# EAGLE design counter (EAGLE 9.6.2)
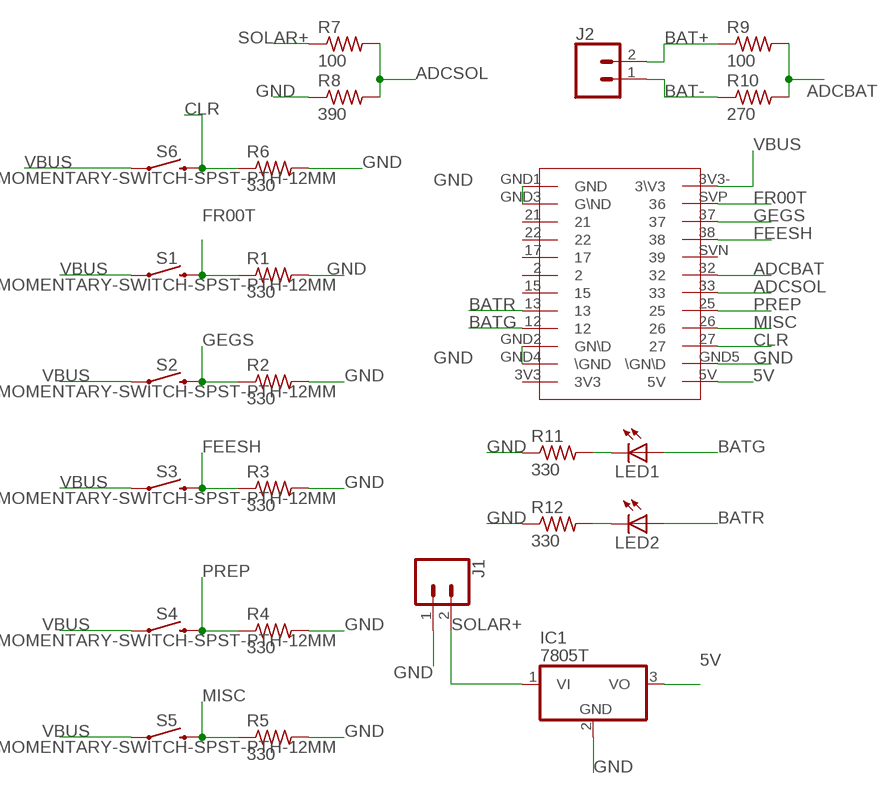
[diagram p0: schematic, sheet 1]

## Parts
IC1  7805T  [TO220H]
J1  CONN_02  [1X02]
J2  CONN_02  [1X02]
LED1  LED3MM  [LED3MM]
LED2  LED3MM  [LED3MM]
R1  330  R-US_0204/7  [0204/7]
R2  330  R-US_0204/7  [0204/7]
R3  330  R-US_0204/7  [0204/7]
R4  330  R-US_0204/7  [0204/7]
R5  330  R-US_0204/7  [0204/7]
R6  330  R-US_0204/7  [0204/7]
R7  100  R-US_0204/7  [0204/7]
R8  390  R-US_0204/7  [0204/7]
R9  100  R-US_0204/7  [0204/7]
R10  270  R-US_0204/7  [0204/7]
R11  330  R-US_0204/7  [0204/7]
R12  330  R-US_0204/7  [0204/7]
S1  MOMENTARY-SWITCH-SPST-PTH-12MM  [TACTILE_SWITCH_PTH_12MM]
S2  MOMENTARY-SWITCH-SPST-PTH-12MM  [TACTILE_SWITCH_PTH_12MM]
S3  MOMENTARY-SWITCH-SPST-PTH-12MM  [TACTILE_SWITCH_PTH_12MM]
S4  MOMENTARY-SWITCH-SPST-PTH-12MM  [TACTILE_SWITCH_PTH_12MM]
S5  MOMENTARY-SWITCH-SPST-PTH-12MM  [TACTILE_SWITCH_PTH_12MM]
S6  MOMENTARY-SWITCH-SPST-PTH-12MM  [TACTILE_SWITCH_PTH_12MM]
U$1  TTGO-4MB  [ESP32-TTGO-TDISPLAY]

## Nets
5V: IC1.3(VO) U$1.5V
ADCBAT: R9.2 R10.2 U$1.32
ADCSOL: R7.2 R8.2 U$1.33
BAT+: J2.2 R9.1
BAT-: J2.1 R10.1
BATG: LED1.A U$1.12
BATR: LED2.A U$1.13
CLR: R6.1 S6.3 U$1.27
FEESH: R3.1 S3.3 U$1.38
FR00T: R1.1 S1.3 U$1.SVP
GEGS: R2.1 S2.3 U$1.37
GND: IC1.2(GND) J1.1 R1.2 R2.2 R3.2 R4.2 R5.2 R6.2 R8.1 R11.1 R12.1 U$1.GND1(GND) U$1.GND2(GN\D) U$1.GND3(G\ND) U$1.GND4(\GND) U$1.GND5(\GN\D)
MISC: R5.1 S5.3 U$1.26
N$8: LED1.K(C) R11.2
N$9: LED2.K(C) R12.2
PREP: R4.1 S4.3 U$1.25
SOLAR+: IC1.1(VI) J1.2 R7.1
VBUS: S1.1 S2.1 S3.1 S4.1 S5.1 S6.1 U$1.3V3-(3\V3)
Unconnected: U$1.2 U$1.3V3 U$1.15 U$1.17 U$1.21 U$1.22 U$1.SVN

## Library data of the parts
IC1 = adafruit:78*: Positive VOLTAGE REGULATOR Added bigger pads to the TO-92 package
J1 J2 = SparkFun-Connectors:CONN_02: Multi connection point. Often used as Generic Header-pin footprint for 0.1 inch spaced/style header connections On any of the 0.1 inch spaced packages, you can populate with these: Break Away Headers - Straight <https://www.sparkfun.com/products/116> (PRT-00116) Break Away Male Headers - Right Angle <https://www.sparkfun.com/products/553> (PRT-00553) Female Headers <https://www.sparkfun.com/products/115> (PRT-00115) Break Away Headers - Machine Pin <https://www.sparkfun.com/products/117> (PRT-00117) Break Away Female Headers - Swiss Machine Pin <https://www.sparkfun.com/products/743> (PRT-00743) For SCREWTERMINALS and SPRING TERMINALS visit here: Screw Terimnals on SparkFun.com <https://www.sparkfun.com/search/results?term=Screw+Terminals> (5mm/3.5mm/2.54mm spacing) This device is also useful as a general connection point to wire up your design to another part of your project. Our various solder wires solder well into these plated through hole pads. Hook-Up Wire - Assortment (Stranded, 22 AWG) <https://www.sparkfun.com/products/11375> (PRT-11375) Hook-Up Wire - Assortment (Solid Core, 22 AWG) <https://www.sparkfun.com/products/11367> (PRT-11367) View the entire wire category on our website here <https://www.sparkfun.com/categories/141> Special notes: Molex polarized connector foot print use with: PRT-08233 with associated crimp pins and housings. 2.54_SCREWTERM for use with PRT-10571. 3.5mm Screw Terminal footprints for PRT-08084 5mm Screw Terminal footprints for use with PRT-08432
LED1 LED2 = adafruit:LED: LED OSRAM: - CHIPLED LG R971, LG N971, LY N971, LG Q971, LY Q971, LO R971, LY R971 LH N974, LH R974 LS Q976, LO Q976, LY Q976 LO Q996 - Hyper CHIPLED LW Q18S LB Q993, LB Q99A, LB R99A - SideLED LS A670, LO A670, LY A670, LG A670, LP A670 LB A673, LV A673, LT A673, LW A673 LH A674 LY A675 LS A676, LA A676, LO A676, LY A676, LW A676 LS A679, LY A679, LG A679 - Hyper Micro SIDELED® LS Y876, LA Y876, LO Y876, LY Y876 LT Y87S - SmartLED LW L88C, LW L88S LB L89C, LB L89S, LG L890 LS L89K, LO L89K, LY L89K LS L896, LA L896, LO L896, LY L896 - TOPLED LS T670, LO T670, LY T670, LG T670, LP T670 LSG T670, LSP T670, LSY T670, LOP T670, LYG T670 LG T671, LOG T671, LSG T671 LB T673, LV T673, LT T673, LW T673 LH T674 LS T676, LA T676, LO T676, LY T676, LB T676, LH T676, LSB T676, LW T676 LB T67C, LV T67C, LT T67C, LS T67K, LO T67K, LY T67K, LW E67C LS E67B, LA E67B, LO E67B, LY E67B, LB E67C, LV E67C, LT E67C LW T67C LS T679, LY T679, LG T679 LS T770, LO T770, LY T770, LG T770, LP T770 LB T773, LV T773, LT T773, LW T773 LH T774 LS E675, LA E675, LY E675, LS T675 LS T776, LA T776, LO T776, LY T776, LB T776 LHGB T686 LT T68C, LB T68C - Hyper Mini TOPLED® LB M676 - Mini TOPLED Santana® LG M470 LS M47K, LO M47K, LY M47K Source: http://www.osram.convergy.de/
R1-R12 = adafruit:R-US_: RESISTOR, American symbol
S1-S6 = SparkFun-Switches:MOMENTARY-SWITCH-SPST: Momentary Switch (Pushbutton) - SPST Normally-open (NO) SPST momentary switches (buttons, pushbuttons). Variants PTH-12MM - 12mm square, through-hole Momentary Pushbutton Switch - 12mm Square <https://www.sparkfun.com/products/9190> (COM-09190) PTH-6.0MM, PTH-6.0MM-KIT - 6.0mm square, through-hole Mini Pushbutton Switch <https://www.sparkfun.com/products/97> (COM-00097) KIT package intended for soldering kit's - only one side of pads' copper is exposed. PTH-RIGHT-ANGLE-KIT - Right-angle, through-hole Right Angle Tactile Button <https://www.sparkfun.com/products/10791> - Used on SparkFun BigTime Watch Kit <https://www.sparkfun.com/products/11734> SMD-12MM - 12mm square, surface-mount Tactile Button - SMD (12mm) <https://www.sparkfun.com/products/12993> (COM-12993) Used on SparkFun PicoBoard <https://www.sparkfun.com/products/11888> SMD-4.5MM - 4.5mm Square Trackball Switch Used on SparkFun Blackberry Trackballer Breakout <https://www.sparkfun.com/products/13169> SMD-4.6MMX2.8MM - 4.60mm x 2.80mm, surface mount Used on SparkFun SAMD21 Mini Breakout <https://www.sparkfun.com/products/13664> SMD-5.2MM, SMD-5.2-REDUNDANT - 5.2mm square, surface-mount Mini Pushbutton Switch - SMD <https://www.sparkfun.com/products/8720> (COM-08720) Used on Arduino Pro Mini <https://www.sparkfun.com/products/11114> REDUNDANT package connects both switch circuits together SMD-6.0X3.5MM - 6.0 x 3.5mm, surface mount Momentary Reset Switch SMD <https://www.sparkfun.com/products/8229> (COM-08229) SMD-6.2MM-TALL - 6.2mm square, surface mount Tactile Button - SMD (6mm) <https://www.sparkfun.com/products/12992> Used on SparkFun Digital Sandbox <https://www.sparkfun.com/products/12651> SMD-RIGHT-ANGLE - Right-angle, surface mount Used on SparkFun Block for Intel® Edison - Arduino <https://www.sparkfun.com/products/13036>; PROD_ID: SWCH-09185; SF_SKU: COM-09190
U$1 = EPS32_TTGO_TDISPLAY:TTGO-4MB

## Board
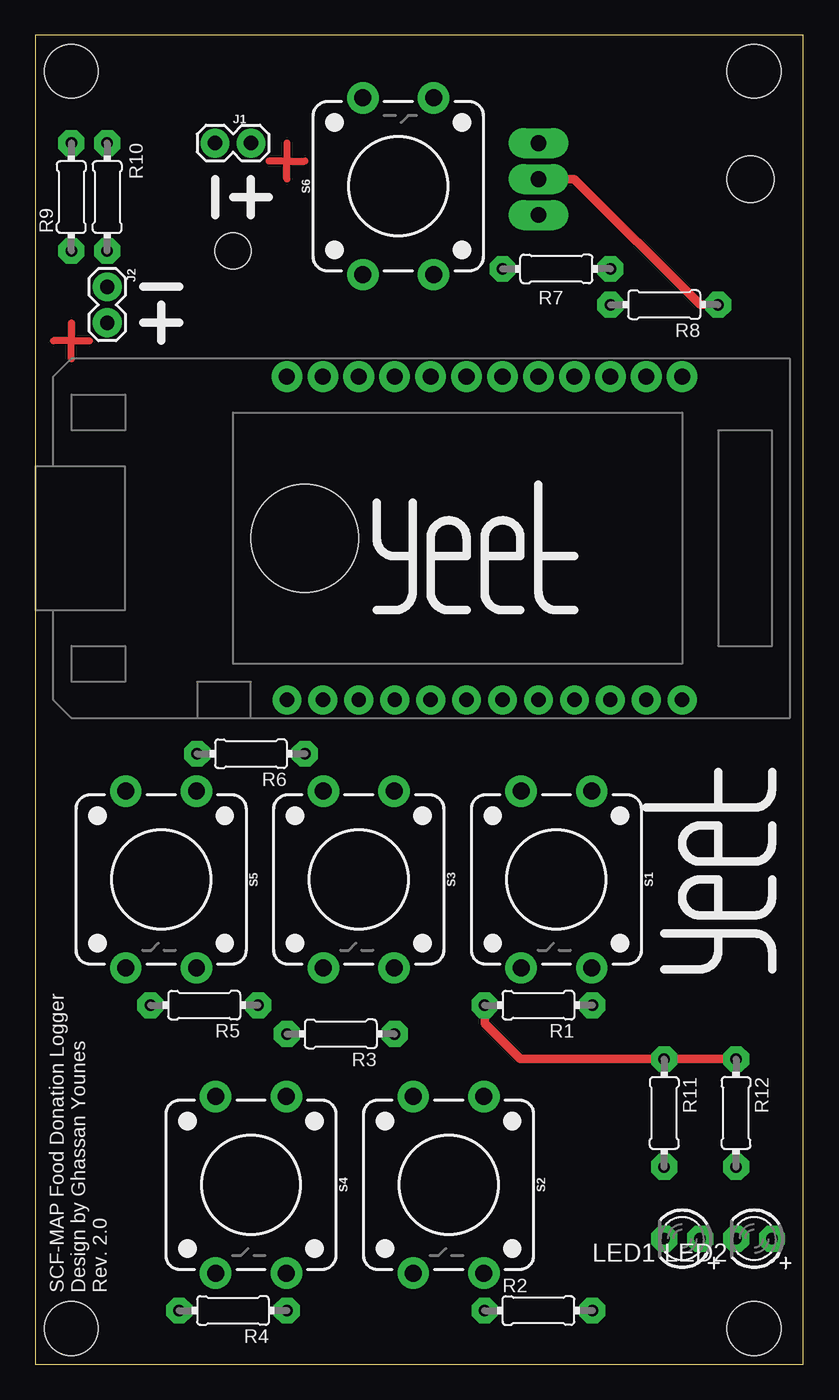
[diagram p1: board, top side]
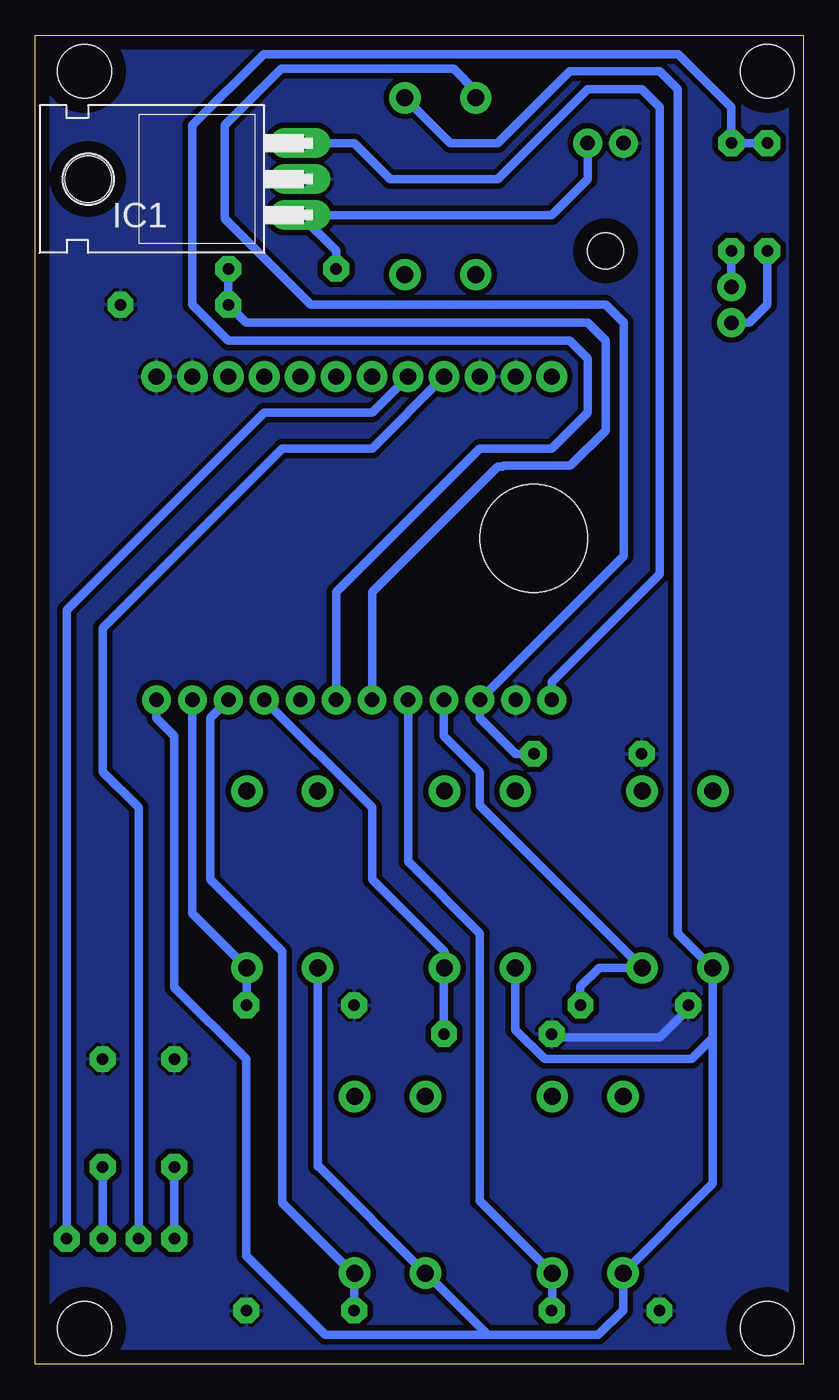
[diagram p2: board, bottom side, seen from below]

Size 54.28 x 93.96 mm. Coordinates in mm from the lower left corner, seen from the top.
Outline: 0,93.96 0,0 54.28,0 54.28,93.96 0,93.96
Copper layers (1*16): Top 0.035mm / dielectric 1.5mm / Bottom 0.035mm
Design rules "default *": minimum track width 6mil, minimum drill 0.35mm, track to track 15mil, track to pad 15mil, pad to pad 15mil, via to via 15mil, smd to smd 6mil, copper to edge 40mil, drill to drill 6mil, minimum pad ring 20mil, minimum via ring 8mil, stop-mask expansion 4mil, vias tented up to drill 0mil, thermal gap 10mil
Holes 3.81 mm at 50.8,91.42 2.54,2.52 50.8,2.52 2.54,91.42
Holes 7.62 mm at 19.05,58.4
Holes 2.54 mm at 13.97,78.72

### Footprints (pad centres in the part's own frame; a part is rotated, then mirrored left to right if it is on the bottom)
TO220H = drill 1.118 long: 1 -2.54,-10.16; 2 0,-10.16; 3 2.54,-10.16 | hole 3.302: 0,4.826
1X02 = drill 1.016 pad 1.88: 1 0,0; 2 2.54,0
LED3MM = drill 0.813 pad 1.676 octagon: A -1.27,0; K 1.27,0
0204/7 = drill 0.813 pad 1.676 octagon: 1 -3.81,0; 2 3.81,0
TACTILE_SWITCH_PTH_12MM = drill 1.2 pad 2.159: 1 6.25,-2.5; 2 -6.25,-2.5; 3 6.25,2.5; 4 -6.25,2.5
ESP32-TTGO-TDISPLAY = drill 1.143 pad 1.778: 2 0,15.24; 3V3 0,0; 12 0,7.62; 13 0,10.16; 15 0,12.7; 17 0,17.78; 21 0,22.86; 22 0,20.32; GND1 0,27.94; GND2 0,25.4; GND3 0,5.08; GND4 0,2.54 | drill 1.016 pad 1.778: 3V3- 22.86,27.94; 5V 22.86,0; 25 22.86,10.16; 26 22.86,7.62; 27 22.86,5.08; 32 22.86,15.24; 33 22.86,12.7; 37 22.86,22.86; 38 22.86,20.32; GND5 22.86,2.54; SVN 22.86,17.78; SVP 22.86,25.4

### Placement (x,y rotation side)
IC1  45.72,83.8 90 bottom
J1  12.7,86.34 0 top
J2  5.08,76.18 270 top
LED1  45.72,8.87 180 top
LED2  50.8,8.87 180 top
R1  35.56,25.38 180 top
R2  35.56,3.79 0 top
R3  21.59,23.35 180 top
R4  13.97,3.79 180 top
R5  11.94,25.38 180 top
R6  15.24,43.16 180 top
R7  36.83,77.45 0 top
R8  44.45,74.91 180 top
R9  2.54,82.53 90 top
R10  5.08,82.53 90 top
R11  44.45,17.76 270 top
R12  49.53,17.76 270 top
S1  36.83,34.27 270 top
S2  29.21,12.68 270 top
S3  22.86,34.27 270 top
S4  15.24,12.68 270 top
S5  8.89,34.27 270 top
S6  25.65,83.29 90 top
U$1  17.78,69.83 270 top

### Tracks (layer width: path | path; a pad name or v marks a point on that pad's centre or on a via)
5V
  Bottom 0.61: IC1.3 31.75,86.34 29.21,83.8 21.59,83.8 15.24,90.15 11.43,90.15 10.16,88.88 10.16,55.86 17.78,48.24 U$1.5V
ADCBAT
  Bottom 0.61: R9.2 R10.2 5.08,88.88 8.84,92.64 38.15,92.64 43.18,87.61 43.18,74.91 40.64,72.37 16.51,72.37 15.24,71.1 15.24,67.29 17.78,64.75 22.86,64.75 33.02,54.59 U$1.32
ADCSOL
  Bottom 0.61: R7.2 R8.2 39.37,73.64 15.24,73.64 13.97,72.37 13.97,66.02 16.46,63.53 21.18,63.53 21.23,63.48 21.59,63.48 30.48,54.59 U$1.33
BAT+
  Bottom 0.61: J2.2 3.81,73.64 2.54,74.91 R9.1
BAT-
  Bottom 0.61: J2.1 R10.1
BATG
  Bottom 0.61: U$1.12 30.48,64.75 36.83,64.75 49.53,52.05 49.53,41.89 46.99,39.35 LED1.A
BATR
  Bottom 0.61: U$1.13 30.48,67.29 38.1,67.29 52.07,53.32 LED2.A
CLR
  Bottom 0.61: S6.3 23.15,90.02 24.72,91.59 36.92,91.59 40.89,87.61 40.89,81.01 34.8,74.91 13.97,74.91 12.7,73.64 12.7,57.13 U$1.27 22.86,45.7 20.32,43.16 R6.1
FEESH
  Bottom 0.61: U$1.38 30.48,39.35 30.48,34.27 25.36,29.15 S3.3 25.4,27.98 R3.1
FR00T
  Bottom 0.61: U$1.SVP 43.18,31.87 S1.3 39.33,25.42 R1.1
GEGS
  Bottom 0.61: U$1.37 41.91,45.7 41.91,34.27 36.83,29.19 36.83,11.41 31.85,6.43 S2.3 31.75,6.39 R2.1
GND
  Top 0.61: IC1.2 38.1,83.8 46.99,74.91 R8.1 | R12.1 R11.1 34.29,21.57 31.75,24.11 R1.2
  Bottom 0.61: R5.2 8.13,25.13 10.16,23.09 17.53,23.09 R3.2
  pour Bottom: 54.61,93.96 54.61,-0.02 0,-0.02 0,91.42 2.54,93.96
MISC
  Bottom 0.61: U$1.26 25.4,44.43 22.86,41.89 22.86,39.49 S5.3 14.44,28.02 15.75,26.71 R5.1
N$1
  Top 0.508: 2.54,73.64 2.54,72.37 | 2.54,71.1 2.54,72.37 | 2.54,72.37 1.27,72.37 | 2.54,72.37 3.81,72.37
N$2
  Top 0.508: 17.78,86.34 17.78,85.07 | 17.78,83.8 17.78,85.07 | 17.78,85.07 16.51,85.07 | 17.78,85.07 19.05,85.07
N$8
  Bottom 0.61: LED1.K R11.2
N$9
  Bottom 0.61: LED2.K R12.2
PREP
  Bottom 0.61: U$1.25 27.94,35.54 22.86,30.46 22.86,11.55 S4.3 17.74,3.83 R4.1
SOLAR+
  Bottom 0.61: J1.2 15.24,83.8 17.78,81.26 IC1.1 33.02,78.72 R7.1
VBUS
  Bottom 0.61: S6.1 24.95,86.34 21.59,86.34 16.51,91.42 10.16,91.42 8.89,90.15 8.89,30.46 6.45,28.02 S5.1 | S5.1 6.39,12.78 S4.1 12.74,3.82 14.48,2.08 22.3,2.08 | 22.3,2.08 26.65,6.43 S2.1 34.23,13.95 34.29,13.95 34.33,13.99 S1.1 | S5.1 6.39,23.05 7.87,21.57 18.29,21.57 20.36,23.64 S3.1 | U$1.3V3- 45.72,45.7 44.45,44.43 44.45,26.65 39.37,21.57 39.37,7.67 33.78,2.08 22.3,2.08

### Text on the board
tNames: SCF-MAP Food Donation Logger / Design by Ghassan Younes / Rev. 2.0